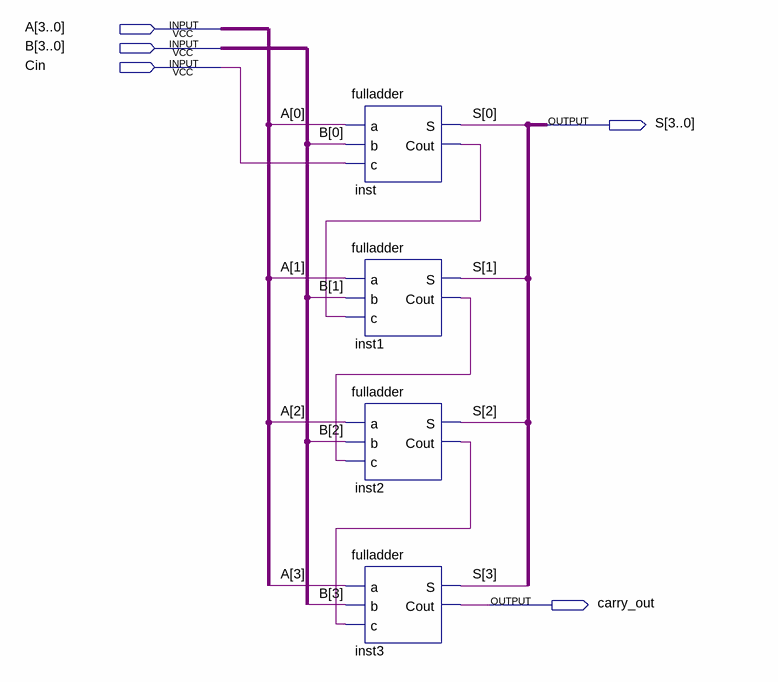
[diagram p0: schematic sheet]
// Quartus schematic lab7.bdf as structural Verilog: 4 symbols, 5 pins
module lab7 (
  input  [3:0] A,
  input  [3:0] B,
  input  Cin,
  output [3:0] S,
  output carry_out
);

  wire inst1_cout, inst2_cout, inst_cout;

  fulladder inst (.a(A[0]), .b(B[0]), .c(Cin), .S(S[0]), .Cout(inst_cout));
  fulladder inst1 (.a(A[1]), .b(B[1]), .c(inst_cout), .S(S[1]), .Cout(inst1_cout));
  fulladder inst2 (.a(A[2]), .b(B[2]), .c(inst1_cout), .S(S[2]), .Cout(inst2_cout));
  fulladder inst3 (.a(A[3]), .b(B[3]), .c(inst2_cout), .S(S[3]), .Cout(carry_out));
endmodule
